# Altium schematic sheet MicrophoneArray.SchDoc
size A
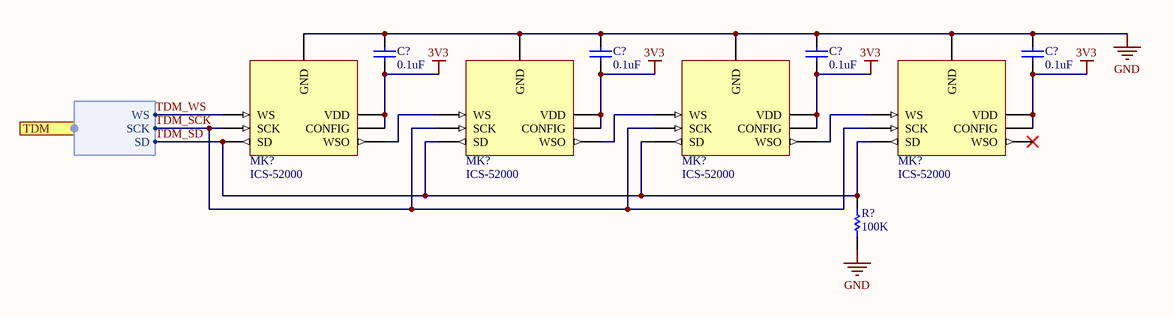
[diagram p0: MicrophoneArray.SchDoc]

## Parts
(Parts that share a designator on the sheet are numbered #1, #2 ... from top to bottom, then left to right.)
C?#1  value 0.1uF  [C0402[1005X55]]  (hidden comment: 0.1uF 6.3V 0402)
C?#2  value 0.1uF  [C0402[1005X55]]  (hidden comment: 0.1uF 6.3V 0402)
C?#3  value 0.1uF  [C0402[1005X55]]  (hidden comment: 0.1uF 6.3V 0402)
C?#4  value 0.1uF  [C0402[1005X55]]  (hidden comment: 0.1uF 6.3V 0402)
MK?#1  ICS-52000  [LGA-7]
MK?#2  ICS-52000  [LGA-7]
MK?#3  ICS-52000  [LGA-7]
MK?#4  ICS-52000  [LGA-7]
R?  value 100K  [R0402[1005]]  (hidden comment: 100K 1% 0402)

## Ports
TDM (harness TDM)

## Harnesses
TDM: WS, SCK, SD

## Nets
3V3: C?#1.1 C?#2.1 C?#3.1 C?#4.1 MK?#1.2(CONFIG) MK?#1.3(VDD) MK?#2.2(CONFIG) MK?#2.3(VDD) MK?#3.2(CONFIG) MK?#3.3(VDD) MK?#4.2(CONFIG) MK?#4.3(VDD)
GND: C?#1.2 C?#2.2 C?#3.2 C?#4.2 MK?#1.4(GND) MK?#2.4(GND) MK?#3.4(GND) MK?#4.4(GND) R?.1
TDM_SCK: MK?#1.6(SCK) MK?#2.6(SCK) MK?#3.6(SCK) MK?#4.6(SCK) ; port TDM.SCK
TDM_SD: MK?#1.7(SD) MK?#2.7(SD) MK?#3.7(SD) MK?#4.7(SD) R?.2 ; port TDM.SD
TDM_WS: MK?#1.5(WS) ; port TDM.WS
NetMK?#1_1: MK?#1.1(WSO) MK?#2.5(WS)
NetMK?#2_1: MK?#2.1(WSO) MK?#3.5(WS)
NetMK?#3_1: MK?#3.1(WSO) MK?#4.5(WS)

Not connected (* = marked no-connect by the designer): MK?#4 1(WSO)*

## Library data of the parts
C?#1-C?#4 = CAP_0.1uF_6.3V_0402_10%: 0.1uF 6.3V 10% 0402 (1005 Metric); PartNumber: GRM155R70J104KA01D; Manufacturer: Murata; Mounting Technology: Surface Mount; PackageReference: 0402; PackageDescription: 0402 (1005 Metric); Voltage: 6.3V; Tolerance: 10%
MK?#1-MK?#4 = ICS-52000: MIC MEMS DIGITAL OMNI -26DB; Manufacturer: TDK InvenSense; PartNumber: ICS-52000; Mounting Technology: Surface Mount; PackageReference: LGA-7
R? = RES_100K_0402_1%: 100K 0.063W 1% 0402 (1005 Metric); Manufacturer: KOA Speer; PartNumber: RK73H1ETTP1003F; Tolerance: 1%; Power: 0.063W; Mounting Technology: Surface Mount; PackageReference: 0402; PackageDescription: 0402 (1005 Metric); ComponentLink1Description: Datasheet; ComponentLink1URL: http://www.koaspeer.com/catimages/Products/RK73H/RK73H.pdf